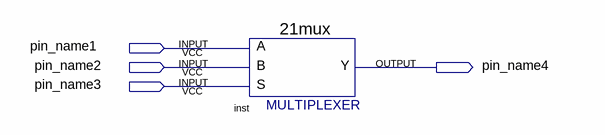
[diagram p0: schematic sheet]
// Quartus schematic muxtest.bdf as structural Verilog: 1 symbols, 4 pins
module muxtest (
  input  pin_name1,
  input  pin_name2,
  input  pin_name3,
  output pin_name4
);

  \21mux  inst (.S(pin_name3), .B(pin_name2), .A(pin_name1), .Y(pin_name4));
endmodule
